# Altium schematic sheet РЕУН.468323.001_EEPROM.SchDoc: =Name-1str
size 420 x 297 mm; SheetNumber: 10; Вид изделия: Документация; Раздел: Документация; Код документа: Э3; Вид документа: Схема электрическая принципиальная; Класс документа: Конструкторский документ; Создавать изделие в PLM: Yes; DocumentCode: РЕУН.468323.001 Э3 2D; DocumentView: Схема электрическая принципиальная; DocumentClass: Конструкторский документ; ProductView: Документация; Format: А3
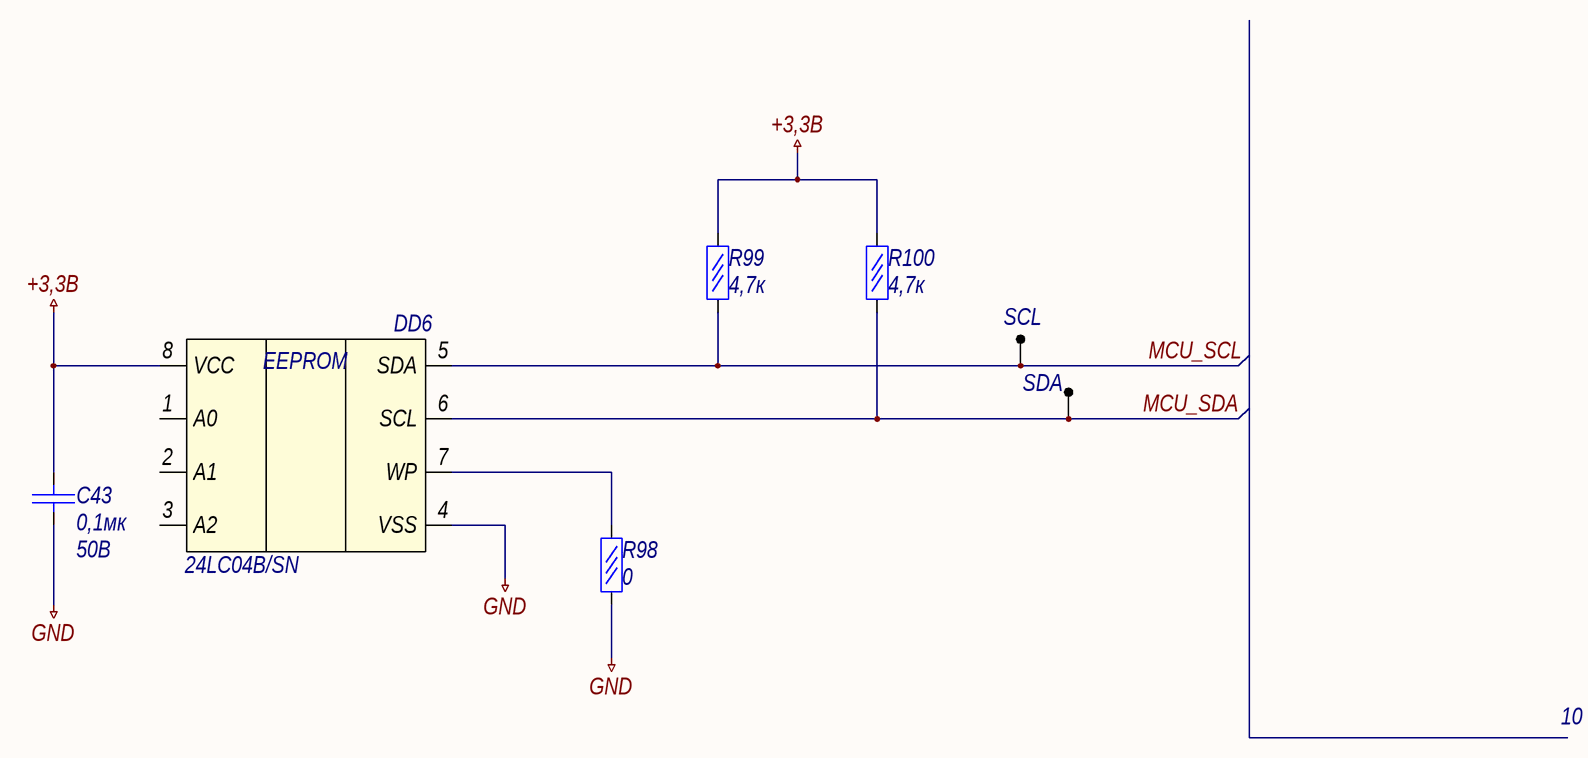
[diagram p0: РЕУН.468323.001_EEPROM.SchDoc]

## Parts
C43  Voltage: 50В  [C0805_AA]  (hidden comment: 0,1мк)
DD6  24LC04B/SN
R98  0  [R1206]
R99  4,7к  [R1206]
R100  4,7к  [R1206]
SCL  "1"  [0.5 x 1_round]  (value not drawn)
SDA  "1"  [0.5 x 1_round]  (value not drawn)

## Nets
+3,3В: C43.2 DD6.8(VCC) R99.2 R100.2
GND: C43.1 DD6.4(VSS) R98.1
MCU_SCL: DD6.5(SDA) R99.1 SCL.1
MCU_SDA: DD6.6(SCL) R100.1 SDA.1
NetDD6_7: DD6.7(WP) R98.2

Not connected (* = marked no-connect by the designer): DD6 1(A0) 2(A1) 3(A2)

## Notes on the sheet
- 10 (Лист 1, 3, 4, 5, 6, 7, 8, 9, 11, 12)
- Подп. и дата
- Инв. № дубл.
- Взам. инв. №
- Инв. № подл.
- Лист
- Изм.
- № докум.
- Подп.
- Дата
- Копировал
- Формат
- (in symbol 24LC04B) EEPROM

## Library data of the parts
C43 = Конденсатор кер.: Value: 0,1мк
DD6 = 24LC04B: 4K I2C Serial EEPROM
R98-R100 = Резистор  0,05Вт: Резистор 0,05Вт; Power rating: 0,05Вт
  R98: Value: 0
  R99 R100: Value: 4,7к
SCL SDA = TestPoint: Test point; Comment_1: "1"